# EAGLE design FT232RL (EAGLE 6.2)
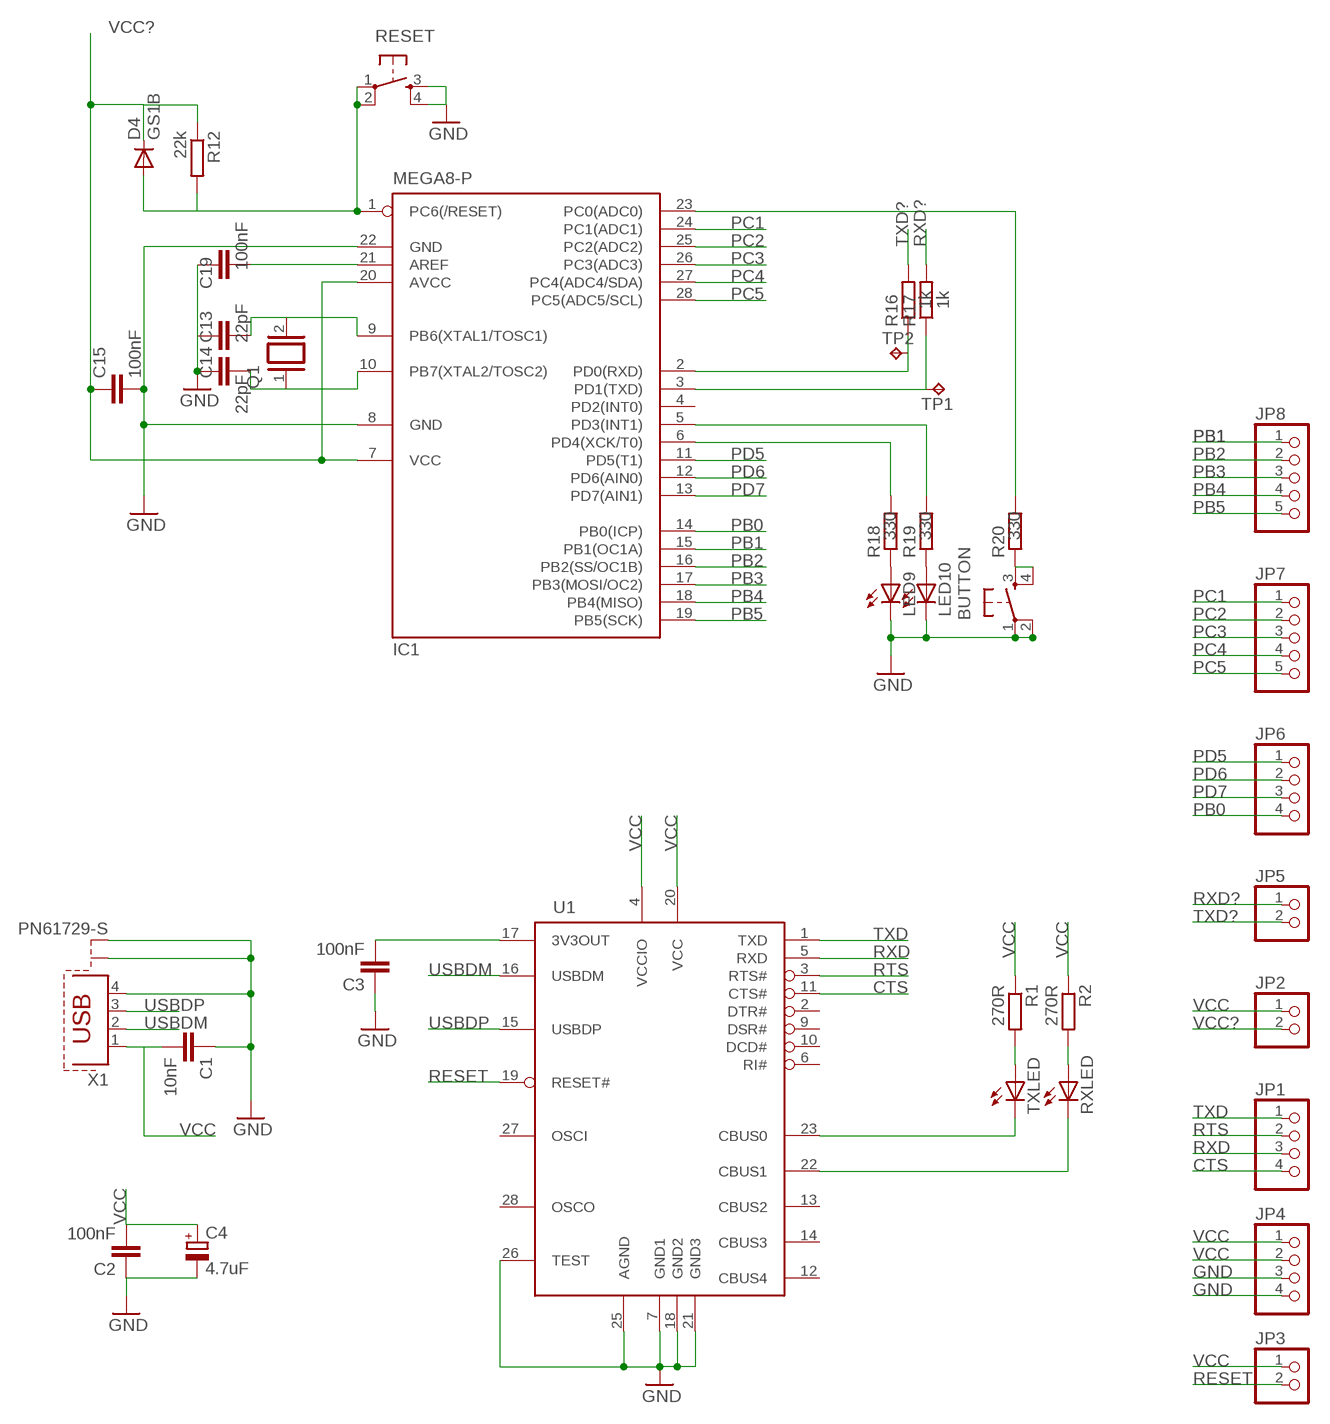
[diagram p0: schematic, sheet 1]

## Parts
BUTTON  TAC_SWITCHSMD  [TACTILE_SWITCH_SMD]
C1  10nF  C-EUC0805  [C0805]
C2  100nF  C-EUC0805  [C0805]
C3  100nF  C-EUC0805  [C0805]
C4  4.7uF  CPOL-EUE1.8-4  [E1,8-4]
C13  22pF  C-EUC0805  [C0805]
C14  22pF  C-EUC0805  [C0805]
C15  100nF  C-EUC0805  [C0805]
C19  100nF  C-EUC0805  [C0805]
D4  GS1B  DIODE-DO214AC  [DO214AC]
IC1  MEGA8-P  [DIL28-3]
JP1  PINHD-1X4  [1X04]
JP2  PINHD-1X2  [1X02]
JP3  PINHD-1X2  [1X02]
JP4  PINHD-1X4  [1X04]
JP5  PINHD-1X2  [1X02]
JP6  PINHD-1X4  [1X04]
JP7  PINHD-1X5  [1X05]
JP8  PINHD-1X5  [1X05]
LED9  LEDSMT1206  [1206]
LED10  LEDSMT1206  [1206]
Q1  XTAL  [Q]
R1  270R  R-EU_R0805  [R0805]
R2  270R  R-EU_R0805  [R0805]
R12  22k  R-EU_R0805  [R0805]
R16  1k  R-EU_R0805  [R0805]
R17  1k  R-EU_R0805  [R0805]
R18  330  R-EU_R0805  [R0805]
R19  330  R-EU_R0805  [R0805]
R20  330  R-EU_R0805  [R0805]
RESET  TAC_SWITCHSMD  [TACTILE_SWITCH_SMD]
RXLED  LEDSML1206  [SML1206]
TP1  TPTP13R  [TP13R]
TP2  TPTP13R  [TP13R]
TXLED  LEDSML1206  [SML1206]
U1  FT232RL  [SSOP28DB]
X1  PN61729-S  [PN61729-S]

## Nets
CTS: JP1.4 U1.11(CTS#)
GND: BUTTON.1 BUTTON.2 C1.1 C2.1 C3.1 C4.- C13.1 C14.1 C15.2 C19.2 IC1.8(GND) IC1.22(GND) JP4.3 JP4.4 LED9.C LED10.C RESET.3 RESET.4 U1.7(GND1) U1.18(GND2) U1.21(GND3) U1.25(AGND) U1.26(TEST) X1.4 X1.S1 X1.S2
N$1: TXLED.C U1.23(CBUS0)
N$2: RXLED.C U1.22(CBUS1)
N$3: R1.2 TXLED.A
N$4: R2.2 RXLED.A
N$5: C3.2 U1.17(3V3OUT)
N$6: IC1.2(PD0(RXD)) R16.1 TP2.TP
N$7: IC1.3(PD1(TXD)) R17.1 TP1.TP
N$8: C19.1 IC1.21(AREF)
N$9: C14.2 IC1.10(PB7(XTAL2/TOSC2)) Q1.1
N$10: C13.2 IC1.9(PB6(XTAL1/TOSC1)) Q1.2
N$38: D4.A IC1.1(PC6(/RESET)) R12.2 RESET.1 RESET.2
N$45: BUTTON.3 BUTTON.4 R20.1
N$46: IC1.6(PD4(XCK/T0)) R18.2
N$50: IC1.5(PD3(INT1)) R19.2
N$52: IC1.23(PC0(ADC0)) R20.2
N$97: LED9.A R18.1
N$98: LED10.A R19.1
PB0: IC1.14(PB0(ICP)) JP6.4
PB1: IC1.15(PB1(OC1A)) JP8.1
PB2: IC1.16(PB2(SS/OC1B)) JP8.2
PB3: IC1.17(PB3(MOSI/OC2)) JP8.3
PB4: IC1.18(PB4(MISO)) JP8.4
PB5: IC1.19(PB5(SCK)) JP8.5
PC1: IC1.24(PC1(ADC1)) JP7.1
PC2: IC1.25(PC2(ADC2)) JP7.2
PC3: IC1.26(PC3(ADC3)) JP7.3
PC4: IC1.27(PC4(ADC4/SDA)) JP7.4
PC5: IC1.28(PC5(ADC5/SCL)) JP7.5
PD5: IC1.11(PD5(T1)) JP6.1
PD6: IC1.12(PD6(AIN0)) JP6.2
PD7: IC1.13(PD7(AIN1)) JP6.3
RESET: JP3.2 U1.19(RESET#)
RTS: JP1.2 U1.3(RTS#)
RXD: JP1.3 U1.5(RXD)
RXD?: JP5.1 R17.2
TXD: JP1.1 U1.1(TXD)
TXD?: JP5.2 R16.2
USBDM: U1.16(USBDM) X1.2
USBDP: U1.15(USBDP) X1.3
VCC: C1.2 C2.2 C4.+ JP2.1 JP3.1 JP4.1 JP4.2 R1.1 R2.1 U1.4(VCCIO) U1.20(VCC) X1.1
VCC?: C15.1 D4.C IC1.7(VCC) IC1.20(AVCC) JP2.2 R12.1
Unconnected: IC1.4(PD2(INT0)) U1.2(DTR#) U1.6(RI#) U1.9(DSR#) U1.10(DCD#) U1.12(CBUS4) U1.13(CBUS2) U1.14(CBUS3) U1.27(OSCI) U1.28(OSCO)

## Library data of the parts
BUTTON RESET = SparkFun:TAC_SWITCH: Momentary Switch Button commonly used for reset or general input. Spark Fun Electronics SKU : COM-00097
C1-C3 C13-C15 C19 = rcl:C-EU: CAPACITOR, European symbol
C4 = rcl:CPOL-EU: POLARIZED CAPACITOR, European symbol
D4 = diode:DIODE-: DIODE
IC1 = atmel:MEGA8-P: MICROCONTROLLER 8 Kbytes FLASH, 1 kbytes SRAM, 512 bytes EEPROM, USART, 4-channel 10 bit ADC, 2-channel 8 bit ADC Pin compatible with Atmega48, ATMega88, ATMega168 Source: avr.lbr; OC_FARNELL: unknown; OC_NEWARK: unknown
JP1 JP4 JP6 = pinhead:PINHD-1X4: PIN HEADER
JP2 JP3 JP5 = pinhead:PINHD-1X2: PIN HEADER
JP7 JP8 = pinhead:PINHD-1X5: PIN HEADER
LED9 LED10 RXLED TXLED = led:LED: LED OSRAM: - CHIPLED LG R971, LG N971, LY N971, LG Q971, LY Q971, LO R971, LY R971 LH N974, LH R974 LS Q976, LO Q976, LY Q976 LO Q996 - Hyper CHIPLED LW Q18S LB Q993, LB Q99A, LB R99A - SideLED LS A670, LO A670, LY A670, LG A670, LP A670 LB A673, LV A673, LT A673, LW A673 LH A674 LY A675 LS A676, LA A676, LO A676, LY A676, LW A676 LS A679, LY A679, LG A679 - Hyper Micro SIDELED® LS Y876, LA Y876, LO Y876, LY Y876 LT Y87S - SmartLED LW L88C, LW L88S LB L89C, LB L89S, LG L890 LS L89K, LO L89K, LY L89K LS L896, LA L896, LO L896, LY L896 - TOPLED LS T670, LO T670, LY T670, LG T670, LP T670 LSG T670, LSP T670, LSY T670, LOP T670, LYG T670 LG T671, LOG T671, LSG T671 LB T673, LV T673, LT T673, LW T673 LH T674 LS T676, LA T676, LO T676, LY T676, LB T676, LH T676, LSB T676, LW T676 LB T67C, LV T67C, LT T67C, LS T67K, LO T67K, LY T67K, LW E67C LS E67B, LA E67B, LO E67B, LY E67B, LB E67C, LV E67C, LT E67C LW T67C LS T679, LY T679, LG T679 LS T770, LO T770, LY T770, LG T770, LP T770 LB T773, LV T773, LT T773, LW T773 LH T774 LS E675, LA E675, LY E675, LS T675 LS T776, LA T776, LO T776, LY T776, LB T776 LHGB T686 LT T68C, LB T68C - Hyper Mini TOPLED® LB M676 - Mini TOPLED Santana® LG M470 LS M47K, LO M47K, LY M47K Source: http://www.osram.convergy.de LUXEON: - LUMILED® LXK2-PW12-R00, LXK2-PW12-S00, LXK2-PW14-U00, LXK2-PW14-V00 LXK2-PM12-R00, LXK2-PM12-S00, LXK2-PM14-U00 LXK2-PE12-Q00, LXK2-PE12-R00, LXK2-PE12-S00, LXK2-PE14-T00, LXK2-PE14-U00 LXK2-PB12-K00, LXK2-PB12-L00, LXK2-PB12-M00, LXK2-PB14-N00, LXK2-PB14-P00, LXK2-PB14-Q00 LXK2-PR12-L00, LXK2-PR12-M00, LXK2-PR14-Q00, LXK2-PR14-R00 LXK2-PD12-Q00, LXK2-PD12-R00, LXK2-PD12-S00 LXK2-PH12-R00, LXK2-PH12-S00 LXK2-PL12-P00, LXK2-PL12-Q00, LXK2-PL12-R00 Source: www.luxeon.com KINGBRIGHT: KA-3528ASYC Source: www.kingbright.com
Q1 = special:XTAL: CRYSTAL
R1 R2 R12 R16-R20 = rcl:R-EU_: RESISTOR, European symbol
TP1 TP2 = testpad:TP: Test pad
U1 = ftdichip-5:FT232RL: USB UART 4th Generation USB UART (USB <-> Serial) Controller
X1 = con-berg:PN61729-S: BERG USB connector; OC_FARNELL: unknown; OC_NEWARK: unknown

## Board
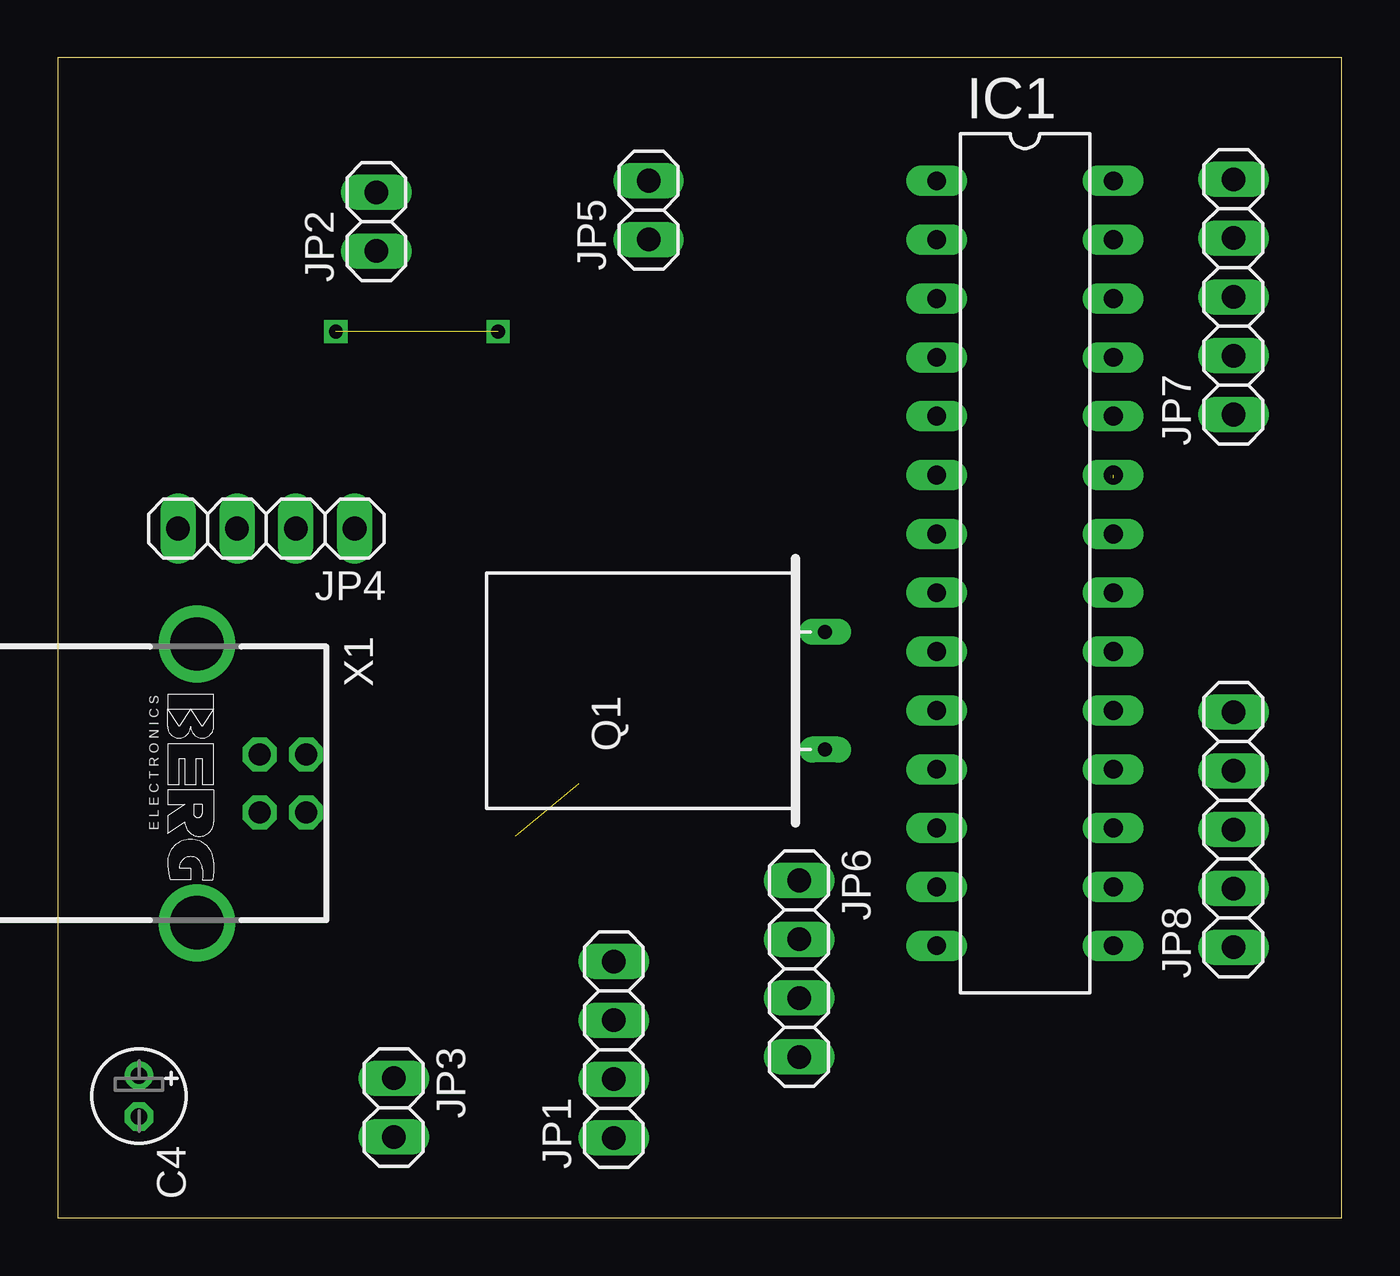
[diagram p1: board, top side]
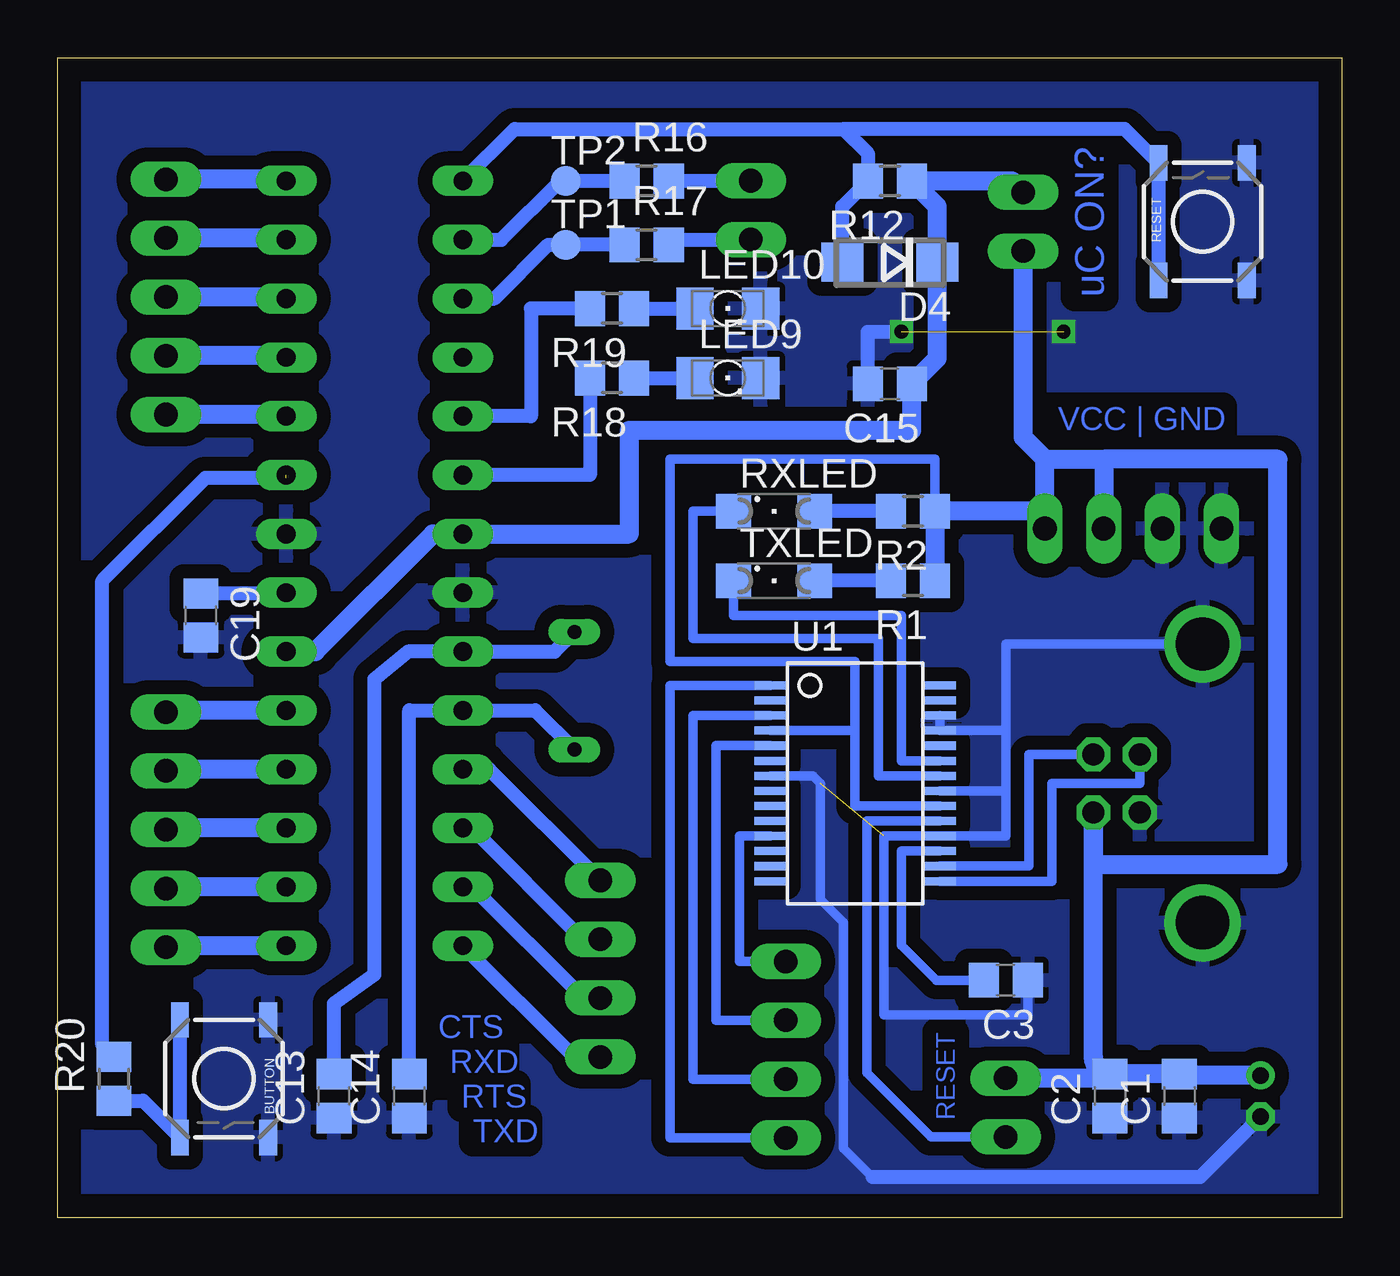
[diagram p2: board, bottom side, seen from below]

Size 55.42 x 50.07 mm. Coordinates in mm from the lower left corner, seen from the top.
Outline: 0,0 55.42,0 55.42,50.07 0,50.07 0,0
Copper layers (1*16): Top 0.035mm / dielectric 1.5mm / Bottom 0.035mm
Design rules: minimum track width 10mil, minimum drill 24mil, track to track 8mil, track to pad 8mil, pad to pad 8mil, via to via 8mil, smd to smd 8mil, copper to edge 40mil, drill to drill 8mil, minimum pad ring 10mil, minimum via ring 8mil, stop-mask expansion 4mil, vias tented up to drill 0mil, thermal gap 10mil

### Footprints (pad centres in the part's own frame; a part is rotated, then mirrored left to right if it is on the bottom)
TACTILE_SWITCH_SMD = smd 1.524 x 0.762: 1 -2.54,1.905; 2 2.54,1.905; 3 -2.54,-1.905; 4 2.54,-1.905
C0805 = smd 1.3 x 1.5: 1 -0.95,0; 2 0.95,0
E1,8-4 = drill 0.711 pad 1.168: + -0.889,0 | drill 0.711 pad 1.168 octagon: - 0.889,0
DO214AC = smd 1.8 x 1.7: A 2.05,0; C -2.05,0
DIL28-3 = drill 0.813 long: 1 -16.51,-3.81; 2 -13.97,-3.81; 3 -11.43,-3.81; 4 -8.89,-3.81; 5 -6.35,-3.81; 6 -3.81,-3.81; 7 -1.27,-3.81; 8 1.27,-3.81; 9 3.81,-3.81; 10 6.35,-3.81; 11 8.89,-3.81; 12 11.43,-3.81; 13 13.97,-3.81; 14 16.51,-3.81; 15 16.51,3.81; 16 13.97,3.81; 17 11.43,3.81; 18 8.89,3.81; 19 6.35,3.81; 20 3.81,3.81; 21 1.27,3.81; 22 -1.27,3.81; 23 -3.81,3.81; 24 -6.35,3.81; 25 -8.89,3.81; 26 -11.43,3.81; 27 -13.97,3.81; 28 -16.51,3.81
1X04 = drill 1.016 long: 1 -3.81,0; 2 -1.27,0; 3 1.27,0; 4 3.81,0
1X02 = drill 1.016 long: 1 -1.27,0; 2 1.27,0
1X05 = drill 1.016 long: 1 -5.08,0; 2 -2.54,0; 3 0,0; 4 2.54,0; 5 5.08,0
1206 = smd 1.6 x 1.803: A -1.422,0; C 1.422,0
Q = drill 0.61 long: 1 -2.54,-7.62; 2 2.54,-7.62
R0805 = smd 1.3 x 1.5: 1 -0.95,0; 2 0.95,0
SML1206 = smd 1.5 x 1.5: A 1.75,0; C -1.75,0
TP13R = smd 1.3 x 1.3: TP 0,0
SSOP28DB = smd 0.348 x 1.397: 1 -4.225,-3.656; 2 -3.575,-3.656; 3 -2.925,-3.656; 4 -2.275,-3.656; 5 -1.625,-3.656; 6 -0.975,-3.656; 7 -0.325,-3.656; 8 0.325,-3.656; 9 0.975,-3.656; 10 1.625,-3.656; 11 2.275,-3.656; 12 2.925,-3.656; 13 3.575,-3.656; 14 4.225,-3.656; 15 4.225,3.656; 16 3.575,3.656; 17 2.925,3.656; 18 2.275,3.656; 19 1.625,3.656; 20 0.975,3.656; 21 0.325,3.656; 22 -0.325,3.656; 23 -0.975,3.656; 24 -1.625,3.656; 25 -2.275,3.656; 26 -2.925,3.656; 27 -3.575,3.656; 28 -4.225,3.656
PN61729-S = drill 0.95 octagon: 1 1.25,4.71; 2 -1.25,4.71; 3 -1.25,2.71; 4 1.25,2.71 | drill 2.3 pad 2.9: S1 -6.02,0; S2 6.02,0

### Placement (x,y rotation side)
BUTTON  48.25,6 270 bottom
C1  7,5.25 90 bottom
C2  10,5.25 90 bottom
C3  14.5,10.25 180 bottom
C4  3.5,5.25 270 top
C13  43.5,5.25 90 bottom
C14  40.25,5.25 90 bottom
C15  19.5,36 180 bottom
C19  49.25,26 270 bottom
D4  19.5,41.25 180 bottom
IC1  41.75,28.25 270 top
JP1  24,7.25 90 top
JP2  13.75,43 90 top
JP3  14.5,4.75 270 top
JP4  9,29.75 180 top
JP5  25.5,43.5 90 top
JP6  32,10.75 270 top
JP7  50.75,39.75 90 top
JP8  50.75,16.75 90 top
LED9  26.5,36.25 0 bottom
LED10  26.5,39.25 0 bottom
Q1  25.5,22.75 90 top
R1  18.5,27.5 180 bottom
R2  18.5,30.5 180 bottom
R12  19.5,44.75 180 bottom
R16  30,44.75 0 bottom
R17  30,42 0 bottom
R18  31.5,36.25 180 bottom
R19  31.5,39.25 180 bottom
R20  53,6 90 bottom
RESET  6,43 90 bottom
RXLED  24.5,30.5 0 bottom
TP1  33.5,42 0 bottom
TP2  33.5,44.75 0 bottom
TXLED  24.5,27.5 0 bottom
U1  21,18.75 270 bottom
X1  6,18.75 270 top

### Tracks (layer width: path | path; a pad name or v marks a point on that pad's centre or on a via)
CTS
  Bottom 0.406: JP1.4 26,11.06 26,16.48 U1.11
GND  (via drill 0.6)  (2 unrouted)
  Bottom 0.406: X1.S1 14.5,24.77 14.5,21.25 | 14.5,21.25 14.5,18.25 | 14.5,18.25 14.5,16.48 U1.18 19.75,16.48 19.75,8.75 13.55,8.75 C3.1 | U1.26 U1.25 14.72,21.02 arc-90 14.5,21.25 | U1.21 14.68,18.43 arc90 14.5,18.25 | U1.7 22.82,19.07 22.5,18.75 22.5,13.75 21.5,12.75 21.5,3 20.25,1.75
  Bottom 0.61: C4.- 6.11,1.75 20.25,1.75 | C15.2 20.45,38.25 v19,38.25
  other vias: 12,38.25
  pour Bottom (isolate 0.61): 0,50 55.5,50 55.5,0 0,0
N$1
  Bottom 0.406: TXLED.C 26.25,26 19,26 19,19.73 U1.23
N$2
  Bottom 0.406: RXLED.C 28,30.5 28,25 20,25 20,19.07 U1.22
N$3
  Bottom 0.61: R1.2 TXLED.A
N$4
  Bottom 0.61: R2.2 RXLED.A
N$5
  Bottom 0.406: C3.2 17.5,10.25 19,11.75 19,15.82 U1.17
N$6
  Bottom 0.61: IC1.2 36.28,42.22 33.75,44.75 TP2.TP R16.1
N$7
  Bottom 0.61: IC1.3 36.57,39.68 34.25,42 TP1.TP R17.1
N$8
  Bottom 0.61: IC1.21 45.56,26.95 C19.1
N$9
  Bottom 0.61: Q1.1 34.81,21.9 IC1.10 40.25,21.9 C14.2
N$10
  Bottom 0.61: Q1.2 33.97,24.44 IC1.9 40.31,24.44 41.75,23.25 41.75,10.5 43.5,9.25 C13.2
N$38
  Bottom 0.61: D4.A 21.55,43.65 R12.2 20.45,45.95 21.5,47 | RESET.1 RESET.2 9.37,47 21.5,47 | IC1.1 35.7,47 21.5,47
N$45
  Bottom 0.61: BUTTON.3 BUTTON.4 51.74,5.05 R20.1
N$46
  Bottom 0.61: R18.2 32.45,32.06 IC1.6
N$50
  Bottom 0.61: R19.2 35,39.25 35,34.6 IC1.5
N$52  (1 unrouted)
  Bottom 0.61: R20.2 53.5,7.45 53.5,27.5 49.06,31.94 45.56,31.94
N$97
  Bottom 0.61: R18.1 LED9.A
N$98
  Bottom 0.61: R19.1 LED10.A
PB0
  Bottom 0.61: JP6.4 33.14,6.94 IC1.14
PB1
  Bottom 0.813: IC1.15 50.68,11.74 JP8.1
PB2
  Bottom 0.813: IC1.16 50.68,14.28 JP8.2
PB3
  Bottom 0.813: IC1.17 50.68,16.82 JP8.3
PB4
  Bottom 0.813: IC1.18 50.68,19.36 JP8.4
PB5
  Bottom 0.813: IC1.19 50.68,21.9 JP8.5
PC1
  Bottom 0.813: IC1.24 45.63,34.67 JP7.1
PC2
  Bottom 0.813: IC1.25 45.63,37.21 JP7.2
PC3
  Bottom 0.813: IC1.26 45.63,39.75 JP7.3
PC4
  Bottom 0.813: IC1.27 45.63,42.29 JP7.4
PC5
  Bottom 0.813: IC1.28 45.63,44.83 JP7.5
PD5
  Bottom 0.61: JP6.1 36.8,19.36 IC1.11
PD6
  Bottom 0.61: JP6.2 32.77,12.02 37.57,16.82 IC1.12
PD7
  Bottom 0.61: JP6.3 32.73,9.48 37.53,14.28 IC1.13
RESET
  Bottom 0.406: JP3.2 17.73,3.48 20.5,6.25 20.5,17.12 U1.19
RTS
  Bottom 0.406: JP1.2 28,5.98 28,21.68 U1.3
RXD
  Bottom 0.406: JP1.3 27,8.52 27,20.38 U1.5
RXD?
  Bottom 0.61: R17.2 28.82,42.23 JP5.1
TXD
  Bottom 0.406: JP1.1 29,3.44 29,22.98 U1.1
TXD?
  Bottom 0.61: R16.2 29.03,44.77 JP5.2
USBDM
  Bottom 0.406: X1.2 13.5,20 13.5,15.18 U1.16
USBDP
  Bottom 0.406: X1.3 8.71,18.75 12.5,18.75 12.5,14.53 U1.15
VCC
  Bottom 0.406: 17.5,27.25 R1.1 | U1.4 21,21.02 | 21,21.02 21,24 29,24 29,32.75 17.55,32.75 R2.1 | U1.20 21,17.77 21,21.02
  Bottom 0.61: C2.2 10.18,6.02 | JP4.1 12.81,30.5 | 6.94,6.14 C1.2
  Bottom 0.813: C1.2 C2.2 arc90 10.71,6.91 X1.1 10.71,15.25 2.75,15.25 2.75,32.75 10.27,32.75 | 10.18,6.02 JP3.1 | 10.27,32.75 JP4.2 | 12.81,32.75 12.81,30.5 R2.1 R1.1 | 12.81,32.75 10.27,32.75 | C4.+ 6.94,6.14 | JP2.1 13.75,33.69 12.81,32.75
VCC?
  Bottom 0.813: IC1.20 44.31,24.44 39.23,29.52 IC1.7 30.75,29.52 30.75,34 18.55,34 C15.1 17.45,37.1 D4.C 17.45,43.65 R12.1 14.23,44.75 JP2.2

### Text on the board
Bottom: uC ON? | VCC | GND | RESET | CTS | RXD | RTS | TXD